# EAGLE schematic MotorShieldTestbench_ro (EAGLE 7.7.0)
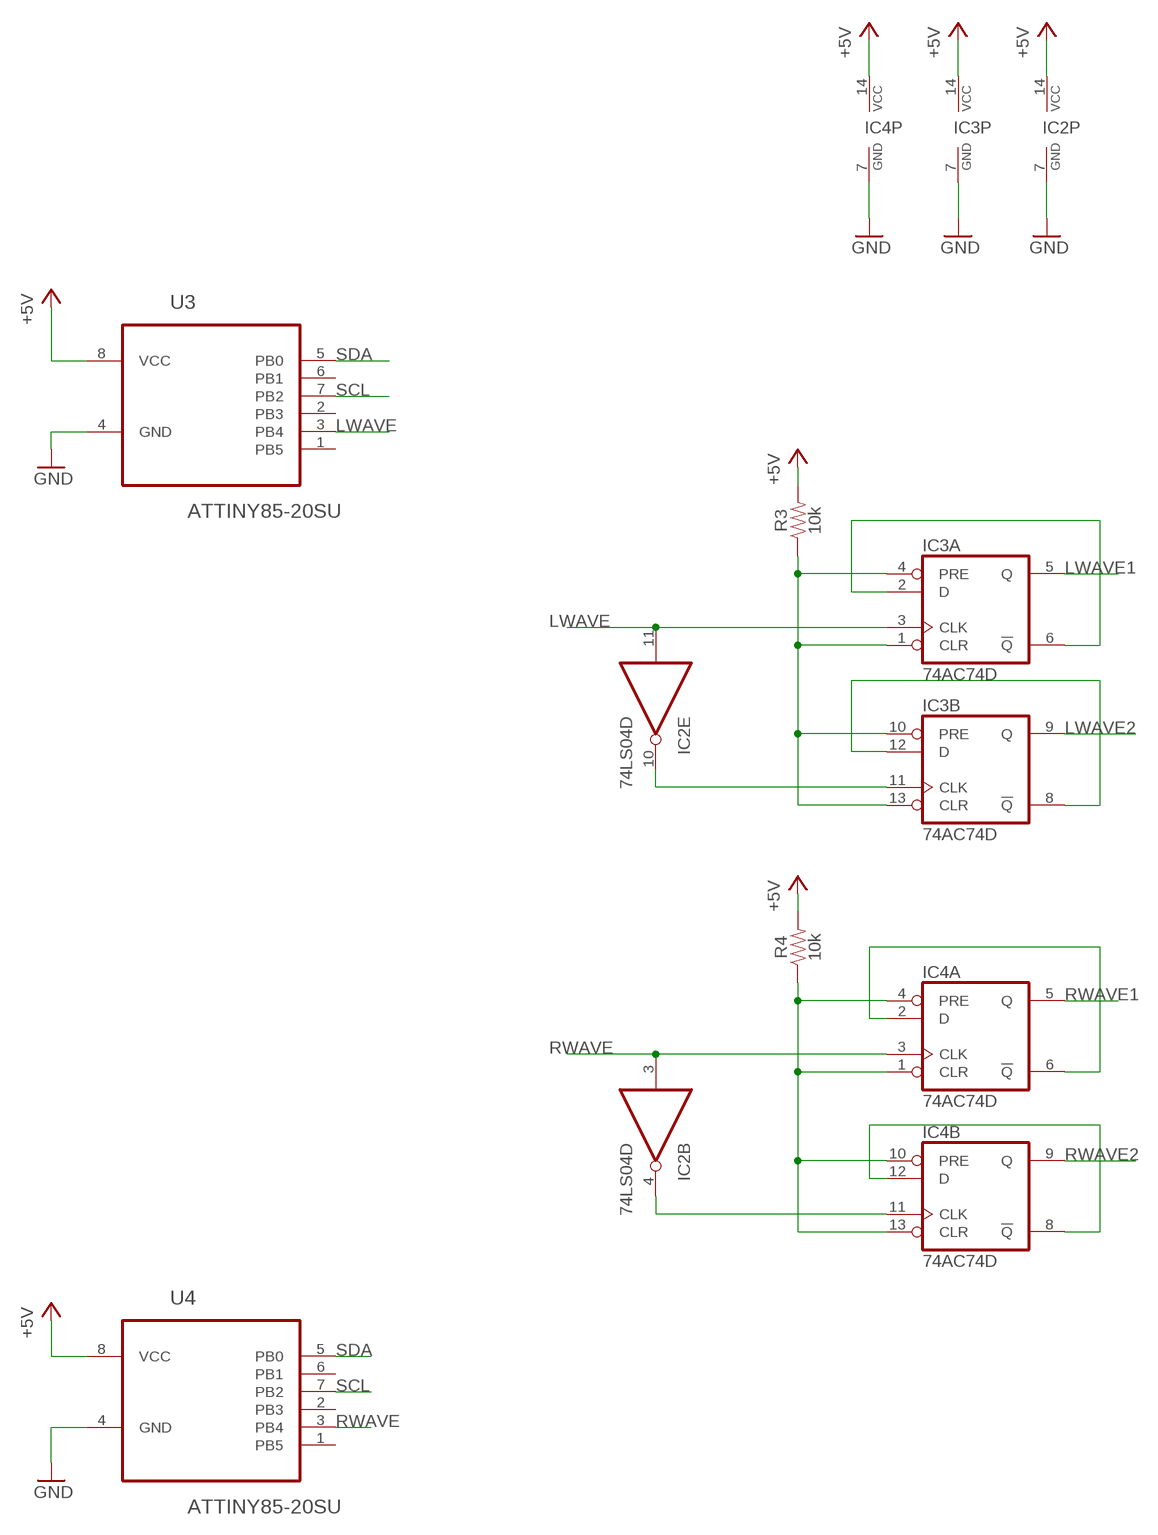
[diagram p0: schematic, sheet 1, part 1 of 2]
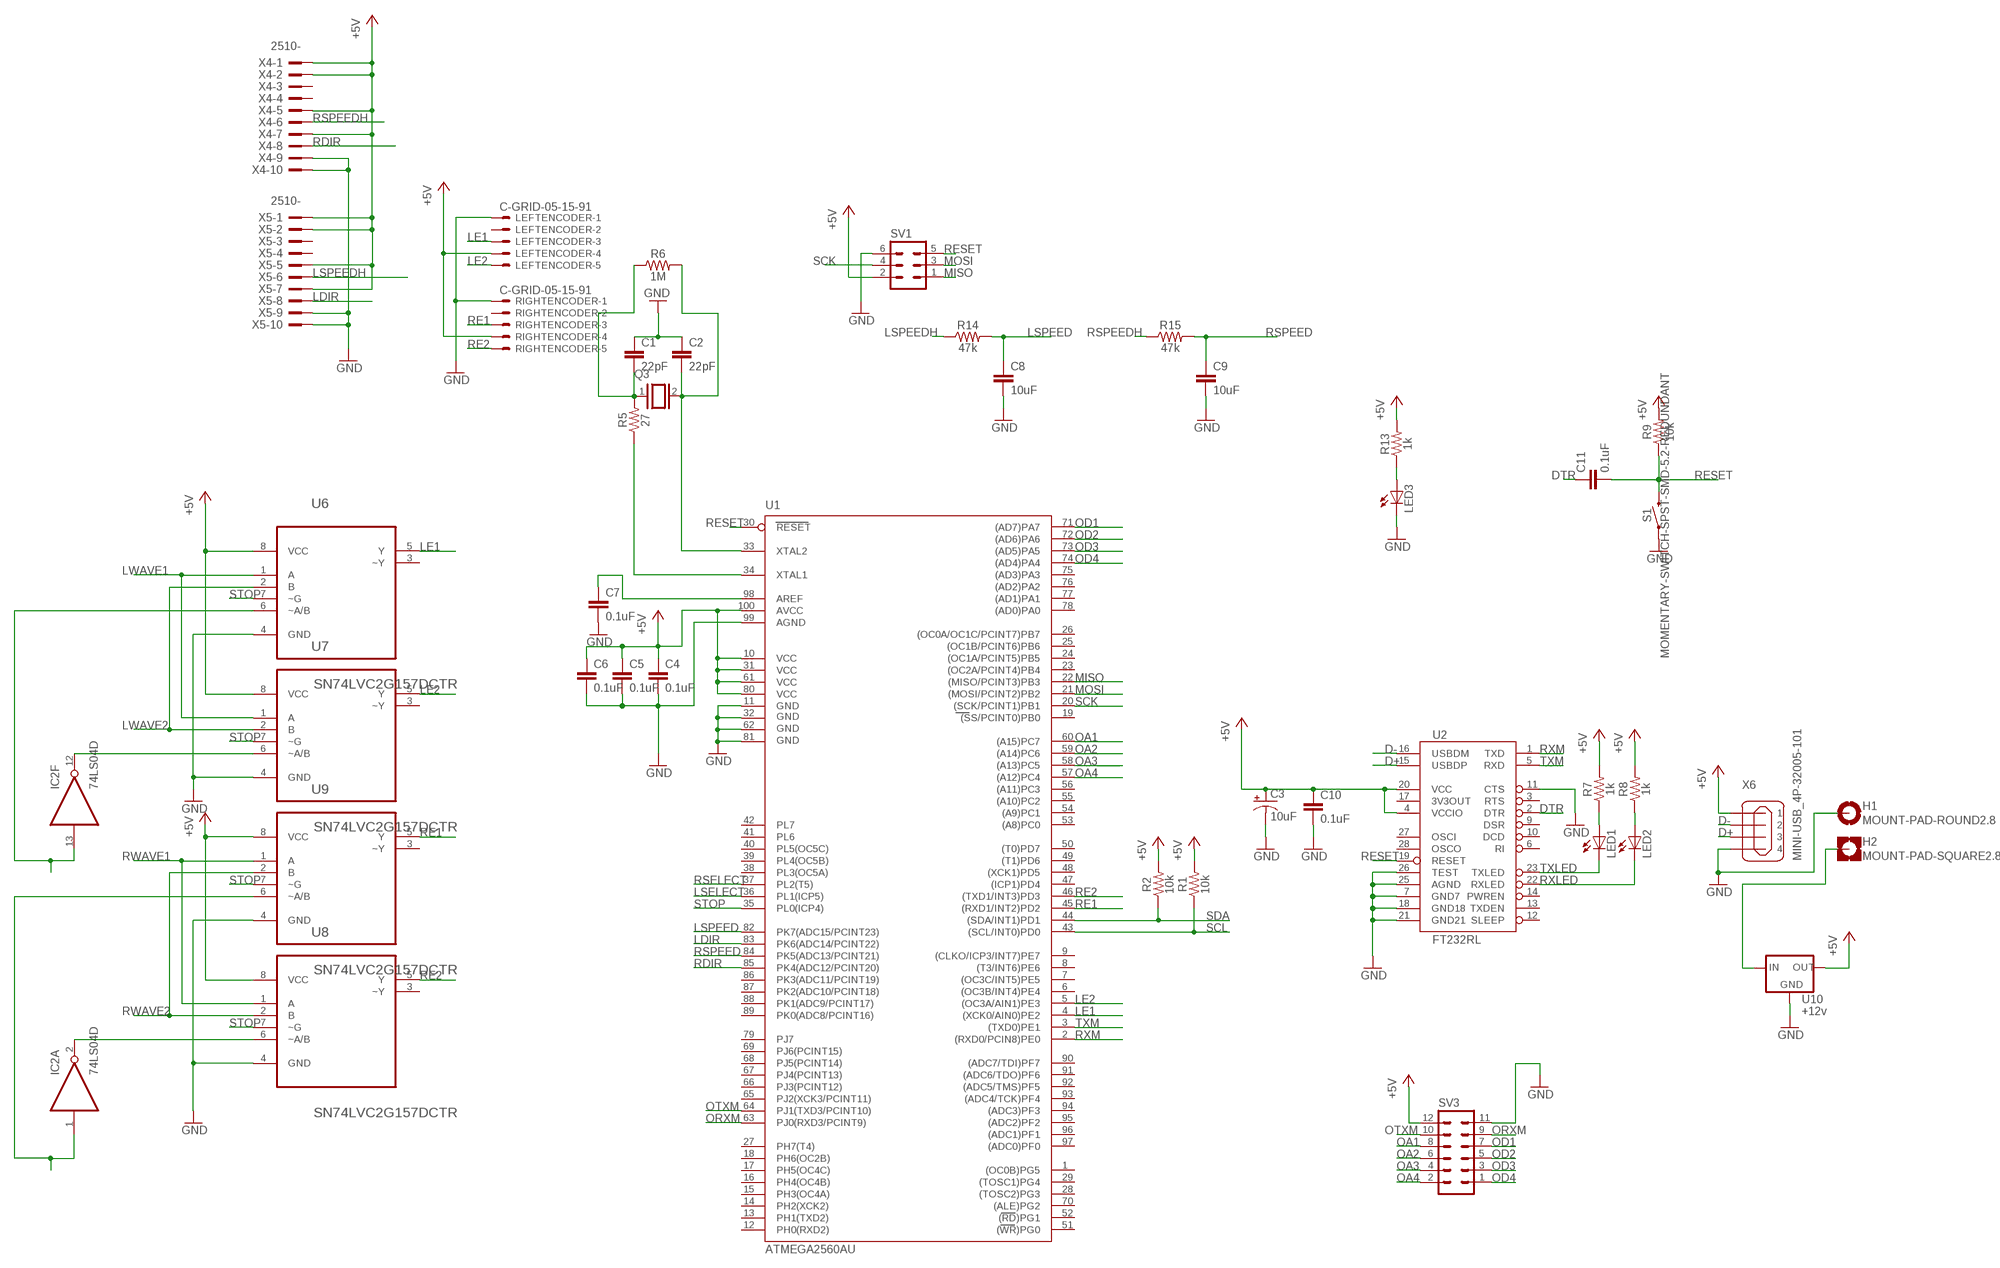
[diagram p1: schematic, sheet 1, part 2 of 2]

## Parts
C1  22pF  22PF-0603-50V-5%  [0603]
C2  22pF  22PF-0603-50V-5%  [0603]
C3  10uF  10UF-POLAR-0603-6.3V-20%(TANT)  [0603-POLAR]
C4  0.1uF  0.1UF-0603-25V-(+80/-20%)  [0603]
C5  0.1uF  0.1UF-0603-25V-(+80/-20%)  [0603]
C6  0.1uF  0.1UF-0603-25V-(+80/-20%)  [0603]
C7  0.1uF  0.1UF-0603-25V-(+80/-20%)  [0603]
C8  10uF  10UF-0603-6.3V-20%  [0603]
C9  10uF  10UF-0603-6.3V-20%  [0603]
C10  0.1uF  0.1UF-0402-16V-10%  [0402]
C11  0.1uF  0.1UF-0603-25V-(+80/-20%)  [0603]
H1  MOUNT-PAD-ROUND2.8  [2,8-PAD]
H2  MOUNT-PAD-SQUARE2.8  [2,8-PAD-SQUARE]
IC2  74LS04D  [SO14]
IC3  74AC74D  [SO14]
IC4  74AC74D  [SO14]
LED1  LED_E  [LED_1206]
LED2  LED_E  [LED_1206]
LED3  LED_E  [LED_1206]
LEFTENCODER  C-GRID-05-15-91  [15-91-05]
Q3  XTAL/S  [QS]
R1  10k  10KOHM-0603-1/10W-1%  [0603]
R2  10k  10KOHM-0603-1/10W-1%  [0603]
R3  10k  10KOHM-0603-1/10W-1%  [0603]
R4  10k  10KOHM-0603-1/10W-1%  [0603]
R5  27  27OHM-0603-1/10W-1%  [0603]
R6  1M  1MOHM-0603-1/4W-5%  [0603]
R7  1k  1KOHM-0603-1/10W-1%  [0603]
R8  1k  1KOHM-0603-1/10W-1%  [0603]
R9  10k  10KOHM-0603-1/10W-1%  [0603]
R13  1k  1KOHM-0603-1/10W-1%  [0603]
R14  47k  47KOHM-0603-1/10W-1%  [0603]
R15  47k  47KOHM-0603-1/10W-1%  [0603]
RIGHTENCODER  C-GRID-05-15-91  [15-91-05]
S1  MOMENTARY-SWITCH-SPST-SMD-5.2-REDUNDANT  [TACTILE_SWITCH_SMD_5.2MM]
SV1  MA03-2  [MA03-2]
SV3  MA06-2  [MA06-2]
U1  ATMEGA2560AU  [TQFP100]
U2  FT232RL  FT232RLSSOP  [SSOP28DB]
U3  ATTINY85-20SU  [SOIC127P798X216-8N]
U4  ATTINY85-20SU  [SOIC127P798X216-8N]
U6  SN74LVC2G157DCTR  [SOP65P400X130-8N]
U7  SN74LVC2G157DCTR  [SOP65P400X130-8N]
U8  SN74LVC2G157DCTR  [SOP65P400X130-8N]
U9  SN74LVC2G157DCTR  [SOP65P400X130-8N]
U10  +12v  V_REG_78XX7812  [TO-252]
X4  2510-  [PAK100/2500-10]
X5  2510-  [PAK100/2500-10]
X6  MINI-USB_4P-32005-101  [32005-101]

## Nets
+5V: C3.+ C4.1 C5.1 C6.1 C10.1 IC2.14(P:VCC) IC3.14(P:VCC) IC4.14(P:VCC) LEFTENCODER.4 R1.2 R2.2 R3.2 R4.2 R7.2 R8.2 R9.2 R13.2 RIGHTENCODER.4 SV1.2 SV3.12 U1.10(VCC) U1.31(VCC1) U1.61(VCC2) U1.80(VCC3) U1.100(AVCC) U2.4(VCCIO) U2.20(VCC) U3.8(VCC) U4.8(VCC) U6.8(VCC) U7.8(VCC) U8.8(VCC) U9.8(VCC) U10.2(OUT) X4.1 X4.2 X4.5 X4.7 X5.1 X5.2 X5.5 X5.7 X6.1
D+: U2.15(USBDP) X6.3
D-: U2.16(USBDM) X6.2
DTR: C11.1 U2.2(DTR)
GND: C1.1 C2.1 C3.- C4.2 C5.2 C6.2 C7.2 C8.2 C9.2 C10.2 H1.B2,8(MOUNT) IC2.7(P:GND) IC3.7(P:GND) IC4.7(P:GND) LED3.C LEFTENCODER.1 RIGHTENCODER.1 S1.1 S1.2 SV1.6 SV3.11 U1.11(GND) U1.32(GND1) U1.62(GND2) U1.81(GND3) U1.99(AGND) U2.7(GND7) U2.11(CTS) U2.18(GND18) U2.21(GND21) U2.25(AGND) U2.26(TEST) U3.4(GND) U4.4(GND) U6.4(GND) U7.4(GND) U8.4(GND) U9.4(GND) U10.3(GND) X4.9 X4.10 X5.9 X5.10 X6.4
LDIR: U1.83(PK6(ADC14/PCINT22)) X5.8
LE1: LEFTENCODER.3 U1.4((XCK0/AIN0)PE2) U6.5(Y)
LE2: LEFTENCODER.5 U1.5((OC3A/AIN1)PE3) U7.5(Y)
LSELECT: IC2.13(F:I) U1.36(PL1(ICP5)) U6.6(~A/B)
LSPEED: C8.1 R14.2 U1.82(PK7(ADC15/PCINT23))
LSPEEDH: R14.1 X5.6
LWAVE: IC2.11(E:I) IC3.3(A:CLK) U3.3(PB4)
LWAVE1: IC3.5(A:Q) U6.1(A) U7.1(A)
LWAVE2: IC3.9(B:Q) U6.2(B) U7.2(B)
MISO: SV1.1 U1.22((MISO/PCINT3)PB3)
MOSI: SV1.3 U1.21((MOSI/PCINT2)PB2)
N$1: IC3.2(A:D) IC3.6(A:!Q)
N$3: IC2.2(A:O) U8.6(~A/B)
N$4: IC3.8(B:!Q) IC3.12(B:D)
N$5: IC4.2(A:D) IC4.6(A:!Q)
N$6: IC4.8(B:!Q) IC4.12(B:D)
N$8: IC2.12(F:O) U7.6(~A/B)
N$9: IC4.1(A:CLR) IC4.4(A:PRE) IC4.10(B:PRE) IC4.13(B:CLR) R4.1
N$10: IC3.1(A:CLR) IC3.4(A:PRE) IC3.10(B:PRE) IC3.13(B:CLR) R3.1
N$14: IC2.4(B:O) IC4.11(B:CLK)
N$22: R5.1 U1.34(XTAL1)
N$24: C2.2 Q3.2 R6.2 U1.33(XTAL2)
N$27: IC2.10(E:O) IC3.11(B:CLK)
N$33: H2.B2,8(MOUNT) U10.1(IN)
N$36: C7.1 U1.98(AREF)
N$37: LED1.A R7.1
N$38: LED2.A R8.1
N$47: LED3.A R13.1
N$63: C1.2 Q3.1 R5.2 R6.1
OA1: SV3.8 U1.60((A15)PC7)
OA2: SV3.6 U1.59((A14)PC6)
OA3: SV3.4 U1.58((A13)PC5)
OA4: SV3.2 U1.57((A12)PC4)
OD1: SV3.7 U1.71((AD7)PA7)
OD2: SV3.5 U1.72((AD6)PA6)
OD3: SV3.3 U1.73((AD5)PA5)
OD4: SV3.1 U1.74((AD4)PA4)
ORXM: SV3.9 U1.63(PJ0(RXD3/PCINT9))
OTXM: SV3.10 U1.64(PJ1(TXD3/PCINT10))
RDIR: U1.85(PK4(ADC12/PCINT20)) X4.8
RE1: RIGHTENCODER.3 U1.45((RXD1/INT2)PD2) U9.5(Y)
RE2: RIGHTENCODER.5 U1.46((TXD1/INT3)PD3) U8.5(Y)
RESET: C11.2 R9.1 S1.3 S1.4 SV1.5 U1.30(RESET) U2.19(RESET)
RSELECT: IC2.1(A:I) U1.37(PL2(T5)) U9.6(~A/B)
RSPEED: C9.1 R15.2 U1.84(PK5(ADC13/PCINT21))
RSPEEDH: R15.1 X4.6
RWAVE: IC2.3(B:I) IC4.3(A:CLK) U4.3(PB4)
RWAVE1: IC4.5(A:Q) U8.1(A) U9.1(A)
RWAVE2: IC4.9(B:Q) U8.2(B) U9.2(B)
RXLED: LED2.C U2.22(RXLED)
RXM: U1.2((RXD0/PCIN8)PE0) U2.1(TXD)
SCK: SV1.4 U1.20((SCK/PCINT1)PB1)
SCL: R1.1 U1.43((SCL/INT0)PD0) U3.7(PB2) U4.7(PB2)
SDA: R2.1 U1.44((SDA/INT1)PD1) U3.5(PB0) U4.5(PB0)
STOP: U1.35(PL0(ICP4)) U6.7(~G) U7.7(~G) U8.7(~G) U9.7(~G)
TXLED: LED1.C U2.23(TXLED)
TXM: U1.3((TXD0)PE1) U2.5(RXD)
Unconnected: IC2.5(C:I) IC2.6(C:O) IC2.8(D:O) IC2.9(D:I) LEFTENCODER.2 RIGHTENCODER.2 U1.1((OC0B)PG5) U1.6((OC3B/INT4)PE4) U1.7((OC3C/INT5)PE5) U1.8((T3/INT6)PE6) U1.9((CLKO/ICP3/INT7)PE7) U1.12(PH0(RXD2)) U1.13(PH1(TXD2)) U1.14(PH2(XCK2)) U1.15(PH3(OC4A)) U1.16(PH4(OC4B)) U1.17(PH5(OC4C)) U1.18(PH6(OC2B)) U1.19((SS/PCINT0)PB0) U1.23((OC2A/PCINT4)PB4) U1.24((OC1A/PCINT5)PB5) U1.25((OC1B/PCINT6)PB6) U1.26((OC0A/OC1C/PCINT7)PB7) U1.27(PH7(T4)) U1.28((TOSC2)PG3) U1.29((TOSC1)PG4) U1.38(PL3(OC5A)) U1.39(PL4(OC5B)) U1.40(PL5(OC5C)) U1.41(PL6) U1.42(PL7) U1.47((ICP1)PD4) U1.48((XCK1)PD5) U1.49((T1)PD6) U1.50((T0)PD7) U1.51((WR)PG0) U1.52((RD)PG1) U1.53((A8)PC0) U1.54((A9)PC1) U1.55((A10)PC2) U1.56((A11)PC3) U1.65(PJ2(XCK3/PCINT11)) U1.66(PJ3(PCINT12)) U1.67(PJ4(PCINT13)) U1.68(PJ5(PCINT14)) U1.69(PJ6(PCINT15)) U1.70((ALE)PG2) U1.75((AD3)PA3) U1.76((AD2)PA2) U1.77((AD1)PA1) U1.78((AD0)PA0) U1.79(PJ7) U1.86(PK3(ADC11/PCINT19)) U1.87(PK2(ADC10/PCINT18)) U1.88(PK1(ADC9/PCINT17)) U1.89(PK0(ADC8/PCINT16)) U1.90((ADC7/TDI)PF7) U1.91((ADC6/TDO)PF6) U1.92((ADC5/TMS)PF5) U1.93((ADC4/TCK)PF4) U1.94((ADC3)PF3) U1.95((ADC2)PF2) U1.96((ADC1)PF1) U1.97((ADC0)PF0) U2.3(RTS) U2.6(RI) U2.9(DSR) U2.10(DCD) U2.12(SLEEP) U2.13(TXDEN) U2.14(PWREN) U2.17(3V3OUT) U2.27(OSCI) U2.28(OSCO) U3.1(PB5) U3.2(PB3) U3.6(PB1) U4.1(PB5) U4.2(PB3) U4.6(PB1) U6.3(~Y) U7.3(~Y) U8.3(~Y) U9.3(~Y) X4.3 X4.4 X5.3 X5.4

## Library data of the parts
C1 C2 = SparkFun-Capacitors:22PF: 22pF ceramic capacitors A capacitor is a passive two-terminal electrical component used to store electrical energy temporarily in an electric field.; PROD_ID: CAP-07876
C3 = SparkFun-Capacitors:10UF-POLAR: 10.0µF polarized capacitors A capacitor is a passive two-terminal electrical component used to store electrical energy temporarily in an electric field.; PROD_ID: CAP-13210
C4-C7 C11 = SparkFun-Capacitors:0.1UF: 0.1µF ceramic capacitors A capacitor is a passive two-terminal electrical component used to store electrical energy temporarily in an electric field.; PROD_ID: CAP-00810
C8 C9 = SparkFun-Capacitors:10UF: 10.0µF ceramic capacitors A capacitor is a passive two-terminal electrical component used to store electrical energy temporarily in an electric field.; PROD_ID: CAP-11015
C10 = SparkFun-Capacitors:0.1UF: 0.1µF ceramic capacitors A capacitor is a passive two-terminal electrical component used to store electrical energy temporarily in an electric field.; PROD_ID: CAP-12416
H1 = holes:MOUNT-PAD-ROUND: MOUNTING PAD, round
H2 = holes:MOUNT-PAD-SQUARE: MOUNTING PAD, square
IC2 = 74xx-eu:74*04: Hex INVERTER
IC3 IC4 = 74xx-eu:74*74: Dual D type positive edge triggered FLIP FLOP, preset and clear
LED1-LED3 = eagle-ltspice:LED_E: LED Source: http://www.osram.convergy.de Source: www.luxeon.com Source: www.kingbright.com; SPICEMODEL: NONE; SPICEPREFIX: D; SPICETYPE: diode
LEFTENCODER RIGHTENCODER = con-molex:C-GRID-05: CONNECTOR wire to board 2.54 mm (0.100") pitch header; OC_FARNELL: unknown; OC_NEWARK: unknown
Q3 = special:XTAL/S: CRYSTAL
R1-R4 R9 = SparkFun-Resistors:10KOHM: 10kΩ resistor A resistor is a passive two-terminal electrical component that implements electrical resistance as a circuit element. Resistors act to reduce current flow, and, at the same time, act to lower voltage levels within circuits. - Wikipedia; PROD_ID: RES-00824
R5 = SparkFun-Resistors:27OHM: 27Ω resistor A resistor is a passive two-terminal electrical component that implements electrical resistance as a circuit element. Resistors act to reduce current flow, and, at the same time, act to lower voltage levels within circuits. - Wikipedia; PROD_ID: RES-09334
R6 = SparkFun-Resistors:1MOHM: 1MΩ resistor A resistor is a passive two-terminal electrical component that implements electrical resistance as a circuit element. Resistors act to reduce current flow, and, at the same time, act to lower voltage levels within circuits. - Wikipedia; PROD_ID: RES-07868
R7 R8 R13 = SparkFun-Resistors:1KOHM: 1kΩ resistor A resistor is a passive two-terminal electrical component that implements electrical resistance as a circuit element. Resistors act to reduce current flow, and, at the same time, act to lower voltage levels within circuits. - Wikipedia; PROD_ID: RES-07856
R14 R15 = SparkFun-Resistors:47KOHM: 47kΩ resistor A resistor is a passive two-terminal electrical component that implements electrical resistance as a circuit element. Resistors act to reduce current flow, and, at the same time, act to lower voltage levels within circuits. - Wikipedia; PROD_ID: RES-07871
S1 = SparkFun-Switches:MOMENTARY-SWITCH-SPST: Momentary Switch (Pushbutton) - SPST Normally-open (NO) SPST momentary switches (buttons, pushbuttons). Variants PTH-12MM - 12mm square, through-hole Momentary Pushbutton Switch - 12mm Square <https://www.sparkfun.com/products/9190> (COM-09190) PTH-6.0MM, PTH-6.0MM-KIT - 6.0mm square, through-hole Mini Pushbutton Switch <https://www.sparkfun.com/products/97> (COM-00097) KIT package intended for soldering kit's - only one side of pads' copper is exposed. PTH-RIGHT-ANGLE-KIT - Right-angle, through-hole Right Angle Tactile Button <https://www.sparkfun.com/products/10791> - Used on SparkFun BigTime Watch Kit <https://www.sparkfun.com/products/11734> SMD-12MM - 12mm square, surface-mount Tactile Button - SMD (12mm) <https://www.sparkfun.com/products/12993> (COM-12993) Used on SparkFun PicoBoard <https://www.sparkfun.com/products/11888> SMD-4.5MM - 4.5mm Square Trackball Switch Used on SparkFun Blackberry Trackballer Breakout <https://www.sparkfun.com/products/13169> SMD-4.6MMX2.8MM - 4.60mm x 2.80mm, surface mount Used on SparkFun SAMD21 Mini Breakout <https://www.sparkfun.com/products/13664> SMD-5.2MM, SMD-5.2-REDUNDANT - 5.2mm square, surface-mount Mini Pushbutton Switch - SMD <https://www.sparkfun.com/products/8720> (COM-08720) Used on Arduino Pro Mini <https://www.sparkfun.com/products/11114> REDUNDANT package connects both switch circuits together SMD-6.0X3.5MM - 6.0 x 3.5mm, surface mount Momentary Reset Switch SMD <https://www.sparkfun.com/products/8229> (COM-08229) SMD-6.2MM-TALL - 6.2mm square, surface mount Tactile Button - SMD (6mm) <https://www.sparkfun.com/products/12992> Used on SparkFun Digital Sandbox <https://www.sparkfun.com/products/12651> SMD-RIGHT-ANGLE - Right-angle, surface mount Used on SparkFun Block for Intel® Edison - Arduino <https://www.sparkfun.com/products/13036>; PROD_ID: SWCH-08247; SF_SKU: COM-08720
SV1 = con-lstb:MA03-2: PIN HEADER; OC_FARNELL: unknown; OC_NEWARK: unknown
SV3 = con-lstb:MA06-2: PIN HEADER; OC_FARNELL: unknown; OC_NEWARK: unknown
U1 = SparkFun-IC-Microcontroller:ATMEGA2560: Atmel 100-pin 8-bit uC 64/128/256 Kbytes FLASH 4 Kbytes EEPROM 8 Kbytes SRAM 86 General Purpose I/O pins 12-channels16-bit PWM 4 x Serial USARTs 16-channels 10-bit A/D SparkFun Products None.; PROD_ID: IC-10040
U2 = SparkFun-IC-Comms:FT232RL: FT232RL USB UART FT232RL 4th Generation USB UART (USB <-> Serial) Controller. Datasheet <http://www.sparkfun.com/datasheets/IC/FT232R_v104.pdf> SparkFun Products Component <https://www.sparkfun.com/products/650> (COM-00650) SparkFun RedBot Mainboard <https://www.sparkfun.com/products/12097> (ROB-12097) SparkFun FTDI Basic Breakout - 5V <https://www.sparkfun.com/products/9716> (DEV-09716) SparkFun FTDI Basic Breakout - 3.3V <https://www.sparkfun.com/products/9873> (DEV-09873) Bus Pirate - v3.6a <https://www.sparkfun.com/products/12942> (TOL-12942) SparkFun USB to Serial Breakout - FT232RL <https://www.sparkfun.com/products/12731> (BOB-12731) SparkFun PicoBoard <https://www.sparkfun.com/products/11888> (WIG-11888) SparkFun RFID USB Reader <https://www.sparkfun.com/products/9963> (SEN-09963) LilyPad FTDI Basic Breakout - 5V <https://www.sparkfun.com/products/10275> (DEV-10275) SparkFun Stepoko <https://www.sparkfun.com/products/13899> (ROB-13899); PROD_ID: IC-00870
U3 U4 = Atmel_By_element14_Batch_1-00:ATTINY85-20SU: 8-bit Microcontroller with In-System Programmable Flash; MPN: ATTINY85-20SU; OC_FARNELL: 1455164; OC_NEWARK: 58M3797; PACKAGE: SOIC-8; SUPPLIER: Atmel
U6-U9 = Texas Instruments_By_element14_Batch_1:SN74LVC2G157DCTR: SINGLE 2-LINE TO 1-LINE DATA SELECTOR/MULTIPLEXER; MPN: SN74LVC2G157DCTR; OC_FARNELL: 1287414; OC_NEWARK: 76C4205; PACKAGE: SOP-8; SUPPLIER: Texas Instruments
U10 = SparkFun-IC-Power:V_REG_78XX: Voltage Regulator Standard 78xx regulator. IGO (Input Ground Output). Spark Fun Electronics SKU : COM-00107; PROD_ID: VREG-12370
X4 X5 = con-3m:2510-: 3M (TM) Pak 100 4-Wall Header Source: 3M; MF: 3M; MPN: 2510-6002UB; OC_FARNELL: 9838244; OC_NEWARK: 46F4725
X6 = con-cypressindustries:MINI-USB_4P-: MINI USB 4 Pol. Source: www.cypressindustries.com; OC_FARNELL: unknown; OC_NEWARK: unknown